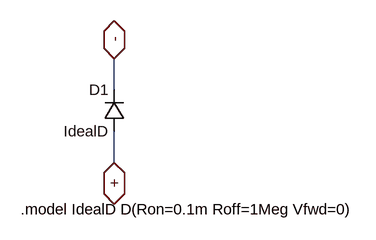
[diagram p0: schematic IdealDiode.asc]
IdealDiode.asc, the LTspice schematic file:
Version 4
SHEET 1 880 680
WIRE 336 144 336 96
WIRE 336 256 336 208
FLAG 336 96 -
IOPIN 336 96 BiDir
FLAG 336 256 +
IOPIN 336 256 BiDir
SYMBOL diode 352 208 R180
WINDOW 0 24 64 Left 2
WINDOW 3 24 0 Left 2
SYMATTR InstName D1
SYMATTR Value IdealD
TEXT 192 328 Left 2 !.model IdealD D(Ron=0.1m Roff=1Meg Vfwd=0)

The netlist it stands for:
* IdealDiode.asc
D1 + - IdealD
.model D D
.lib standard.dio
.model IdealD D(Ron=0.1m Roff=1Meg Vfwd=0)
.backanno
.end